# EAGLE schematic PecanPico7 (EAGLE 7.2.0)
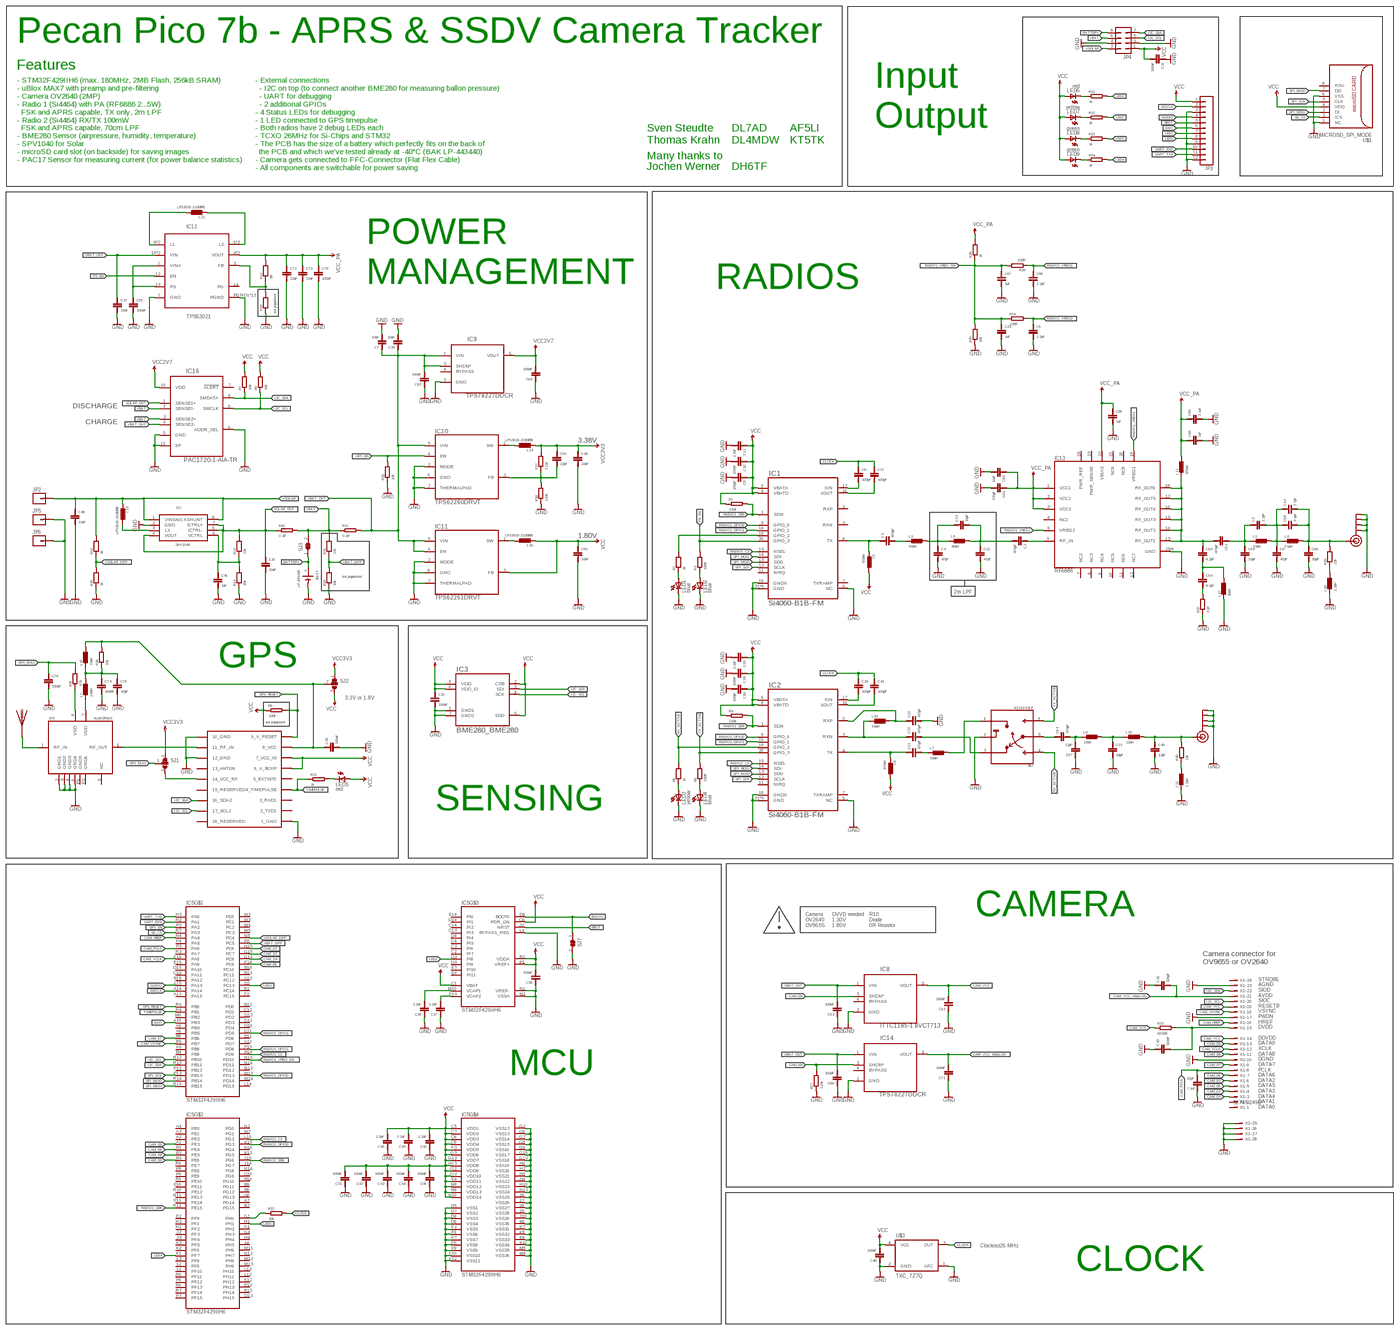
[diagram p0: schematic, sheet 1, overview]
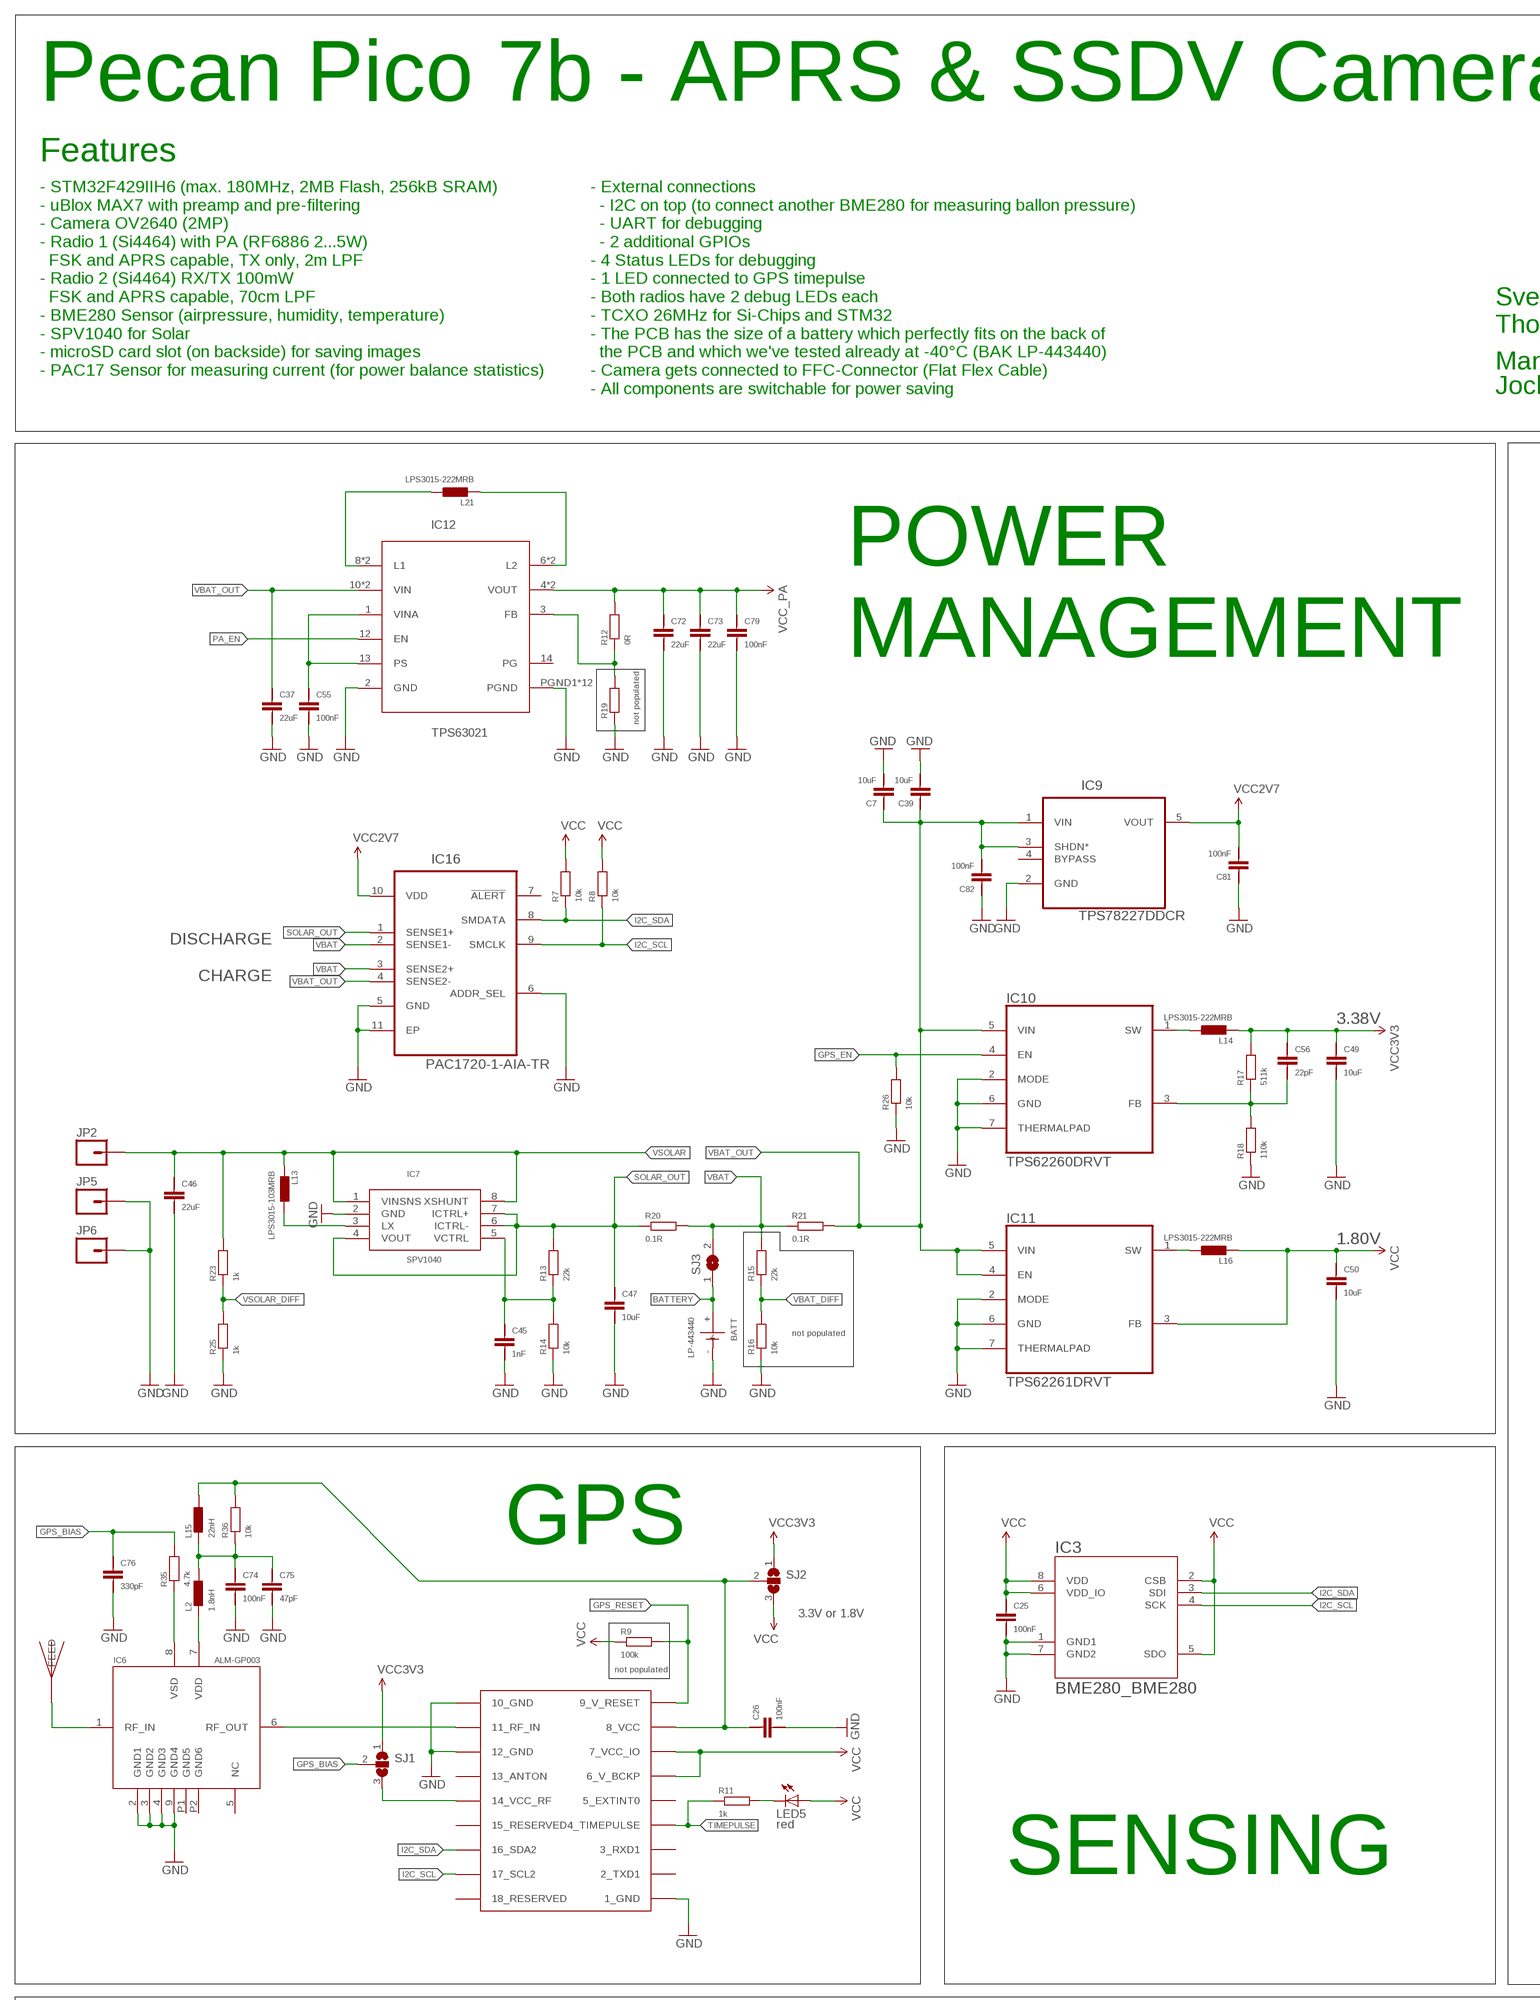
[diagram p1: schematic, sheet 1, part 1 of 4]
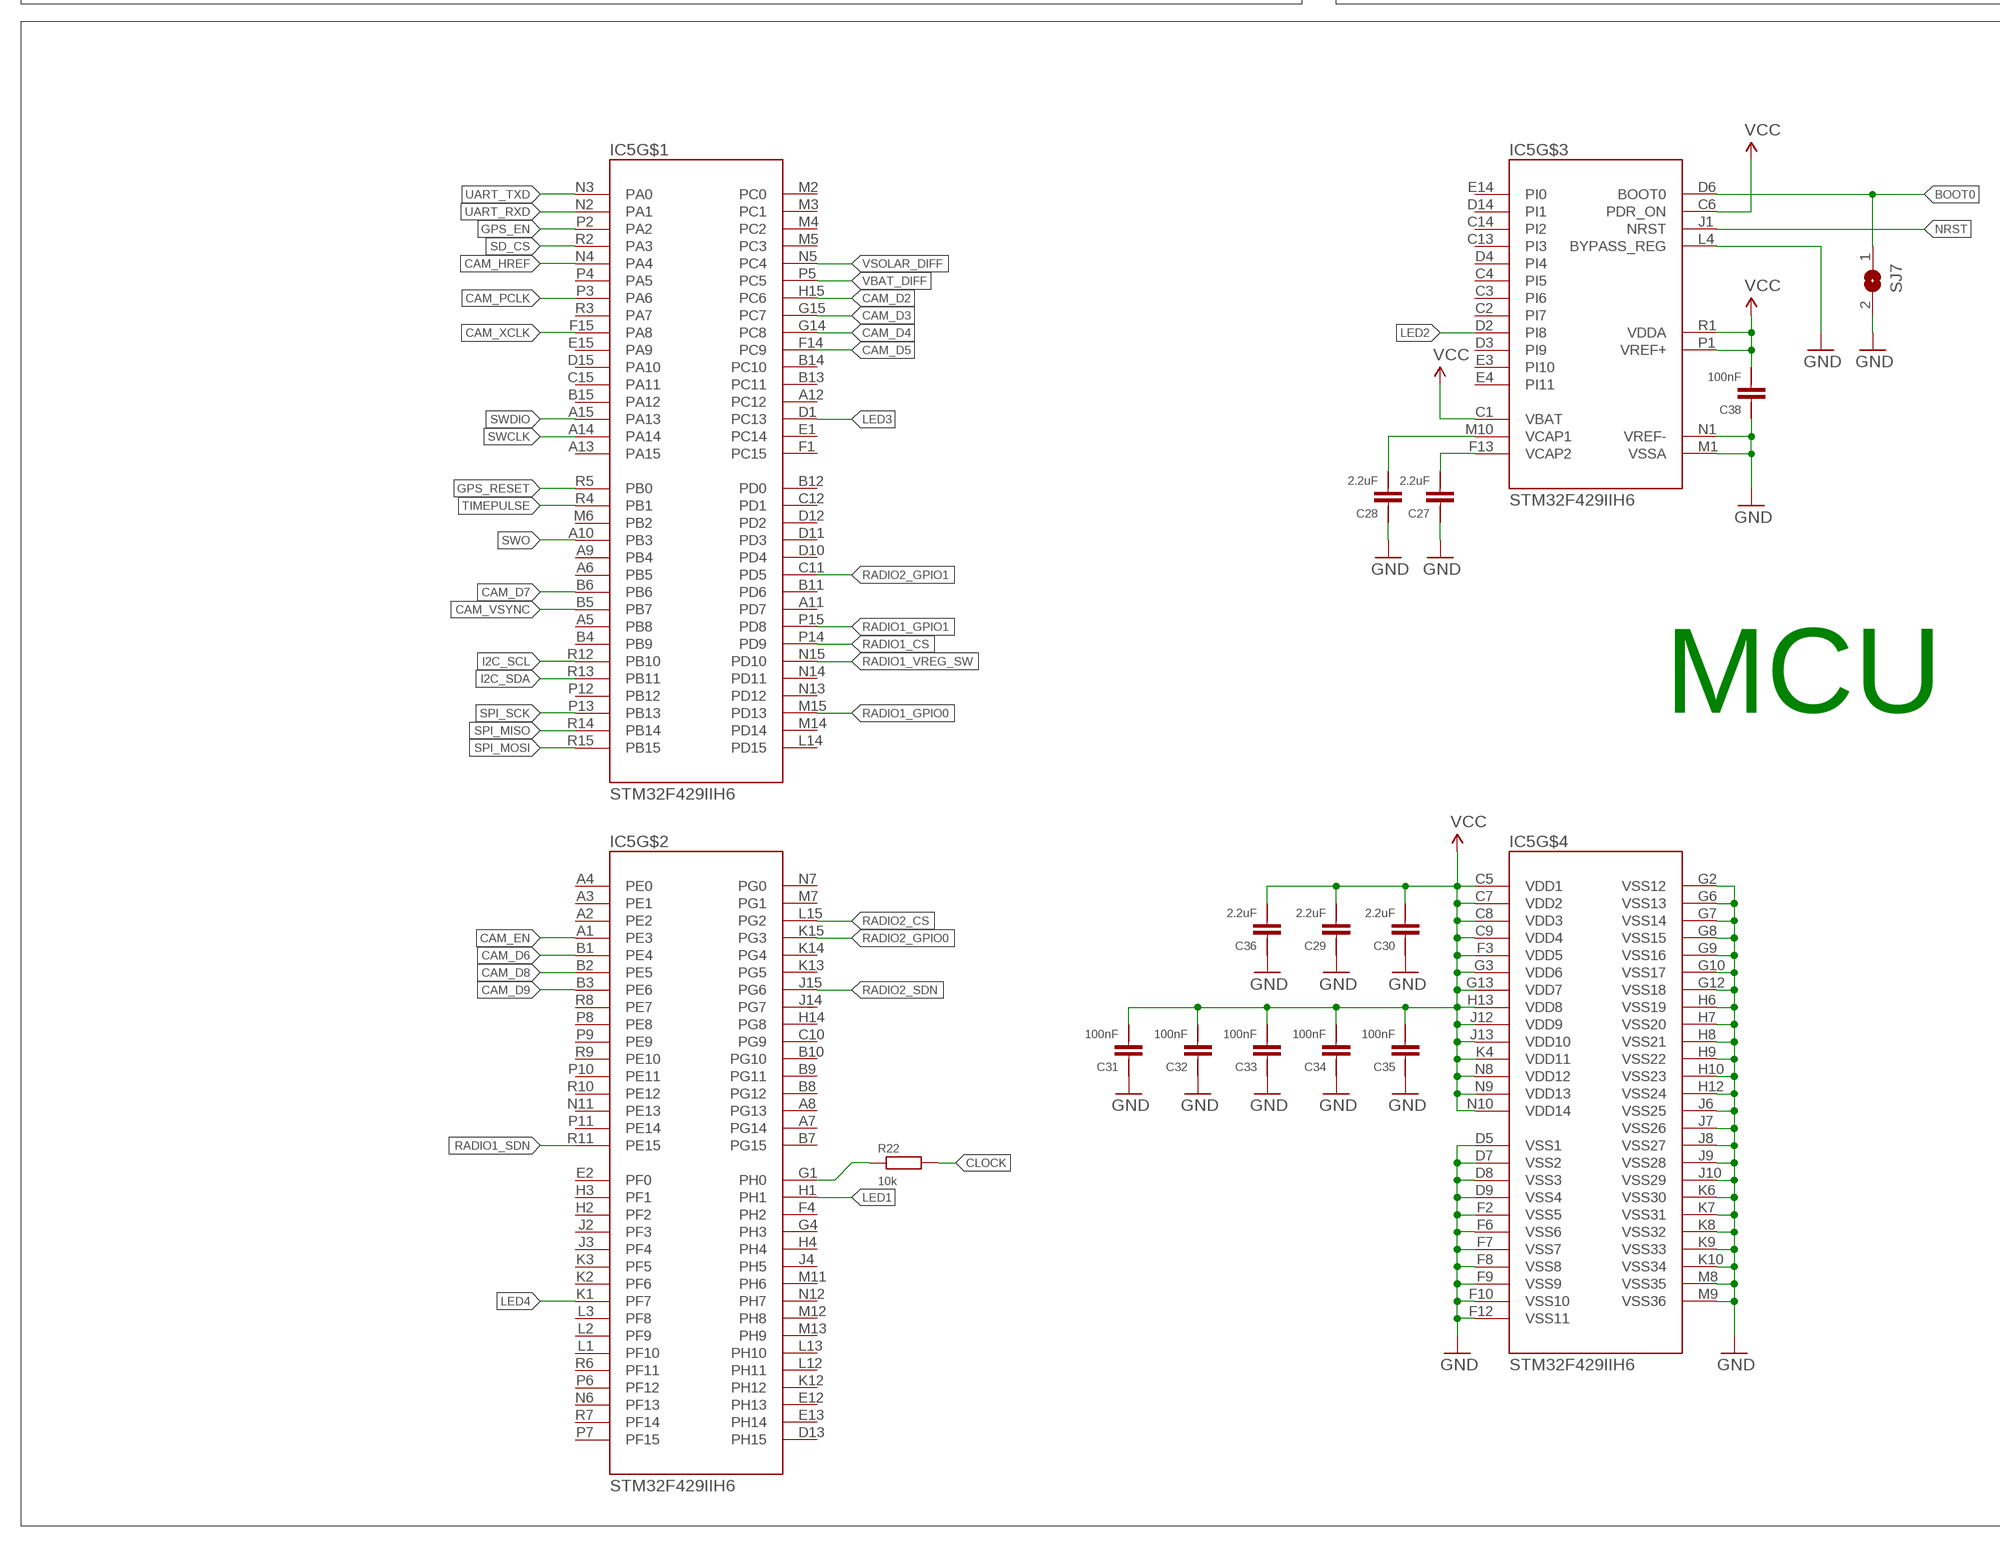
[diagram p2: schematic, sheet 1, part 2 of 4]
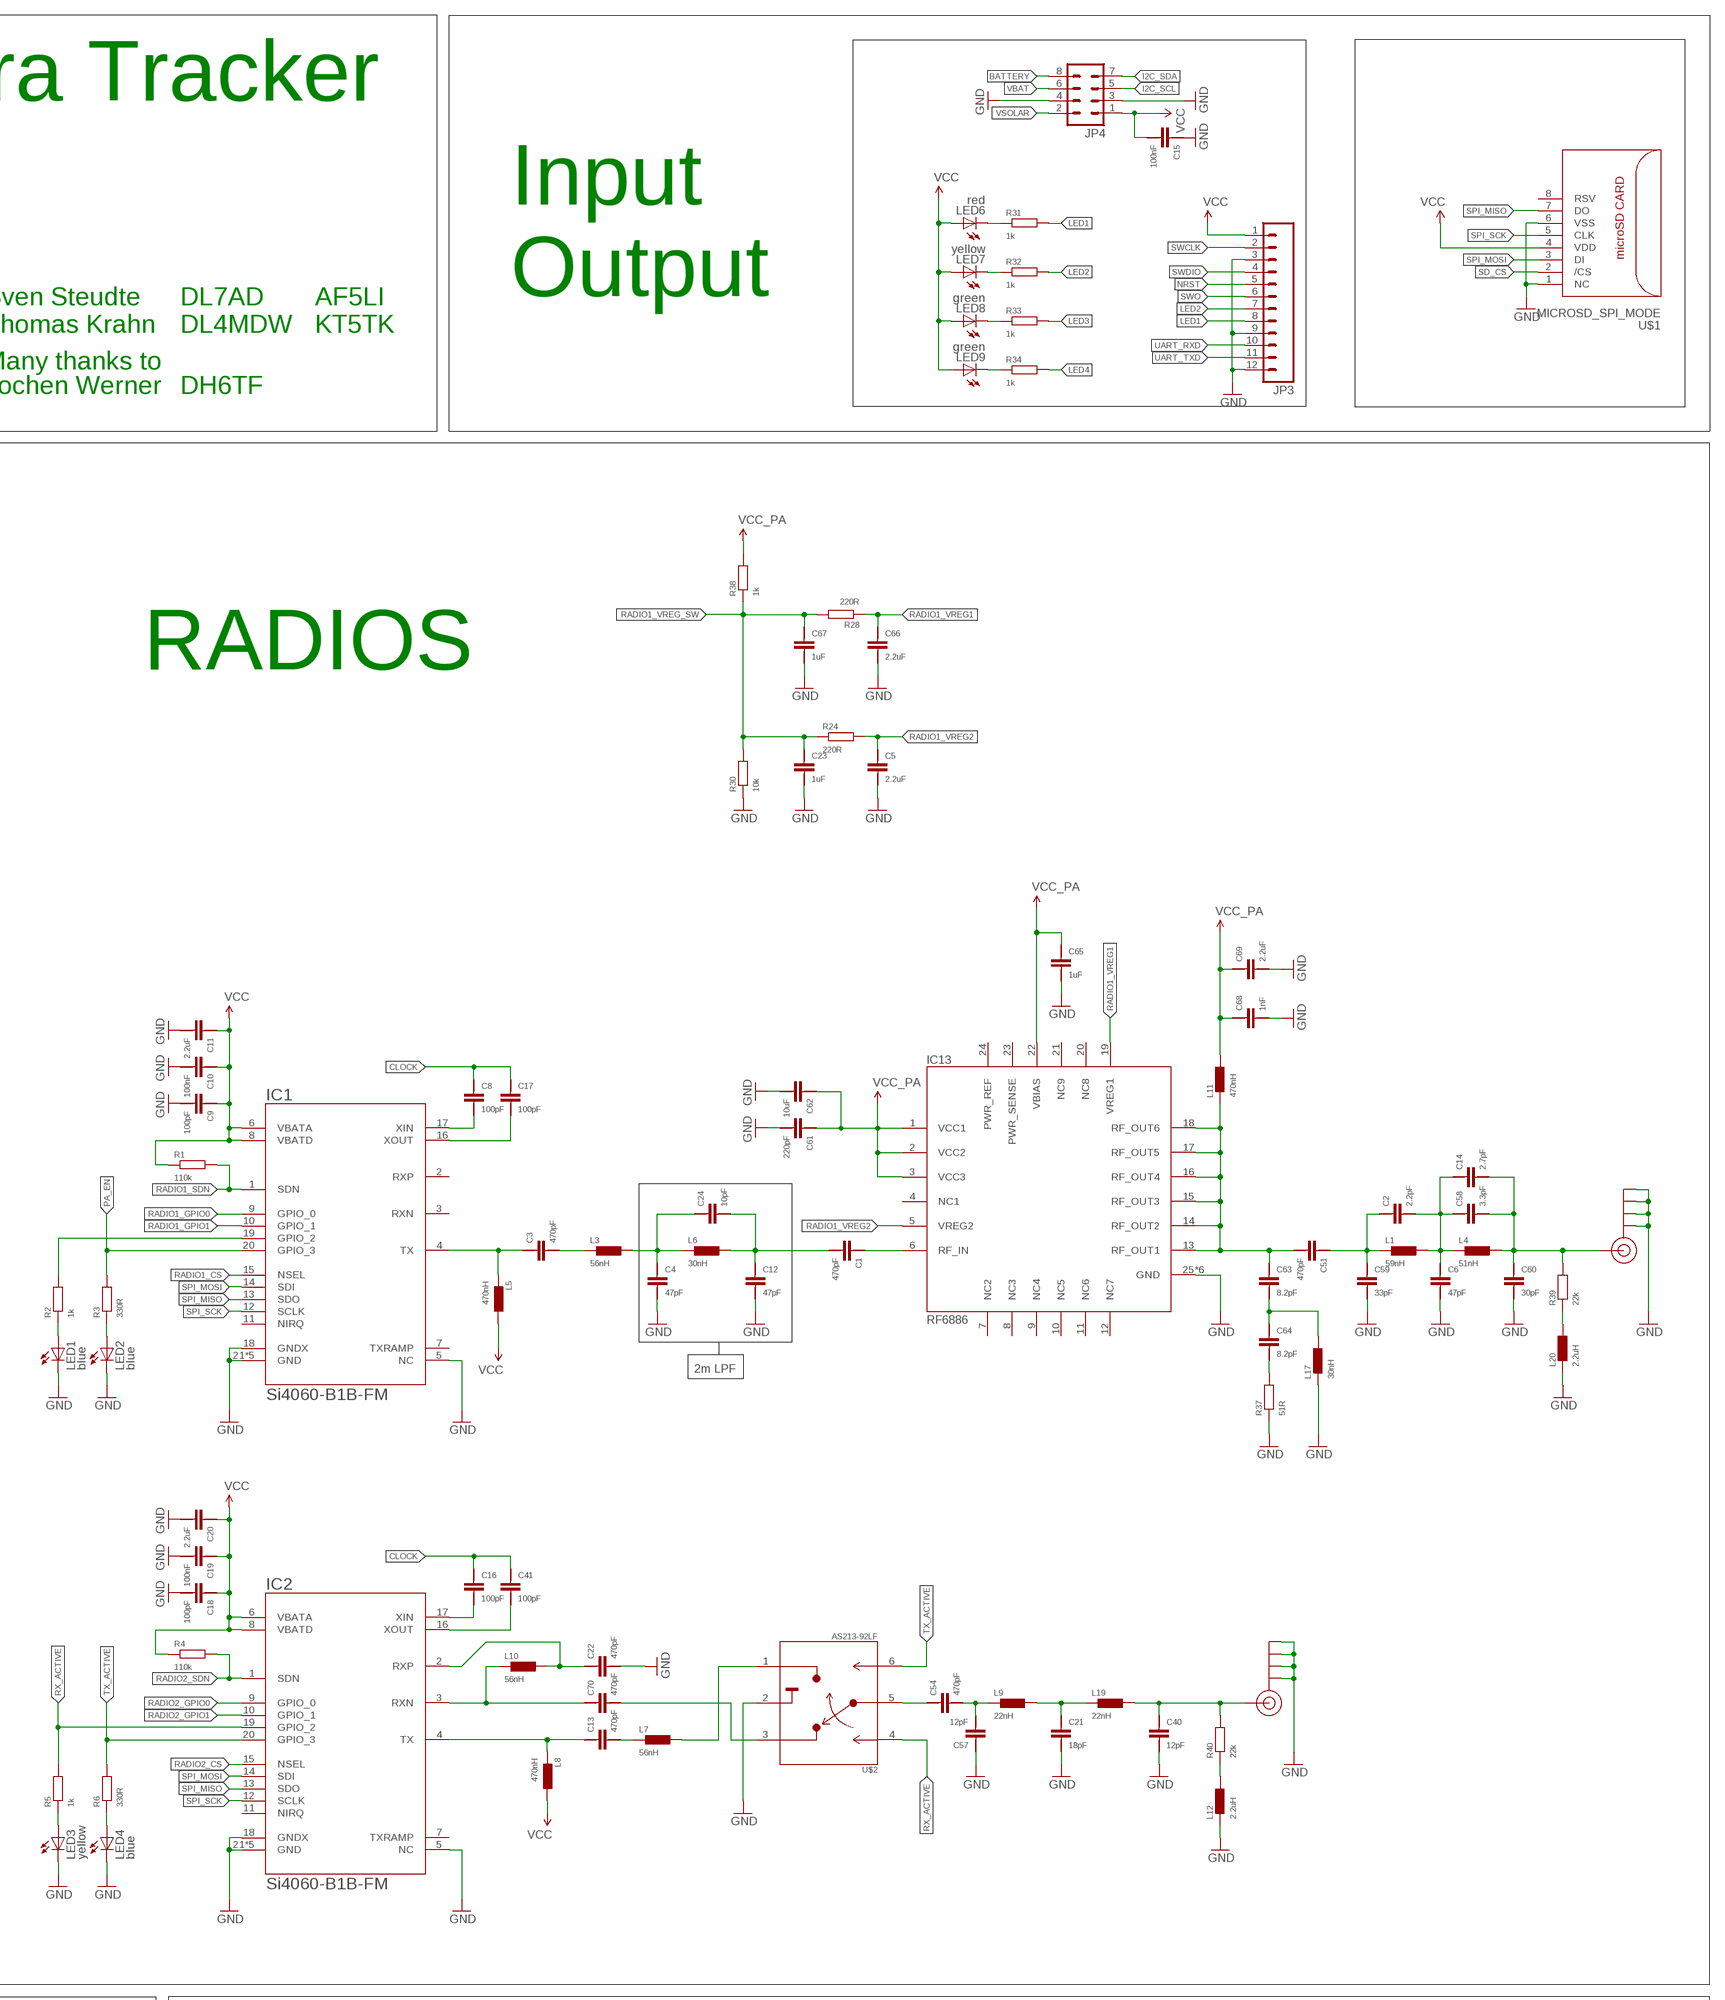
[diagram p3: schematic, sheet 1, part 3 of 4]
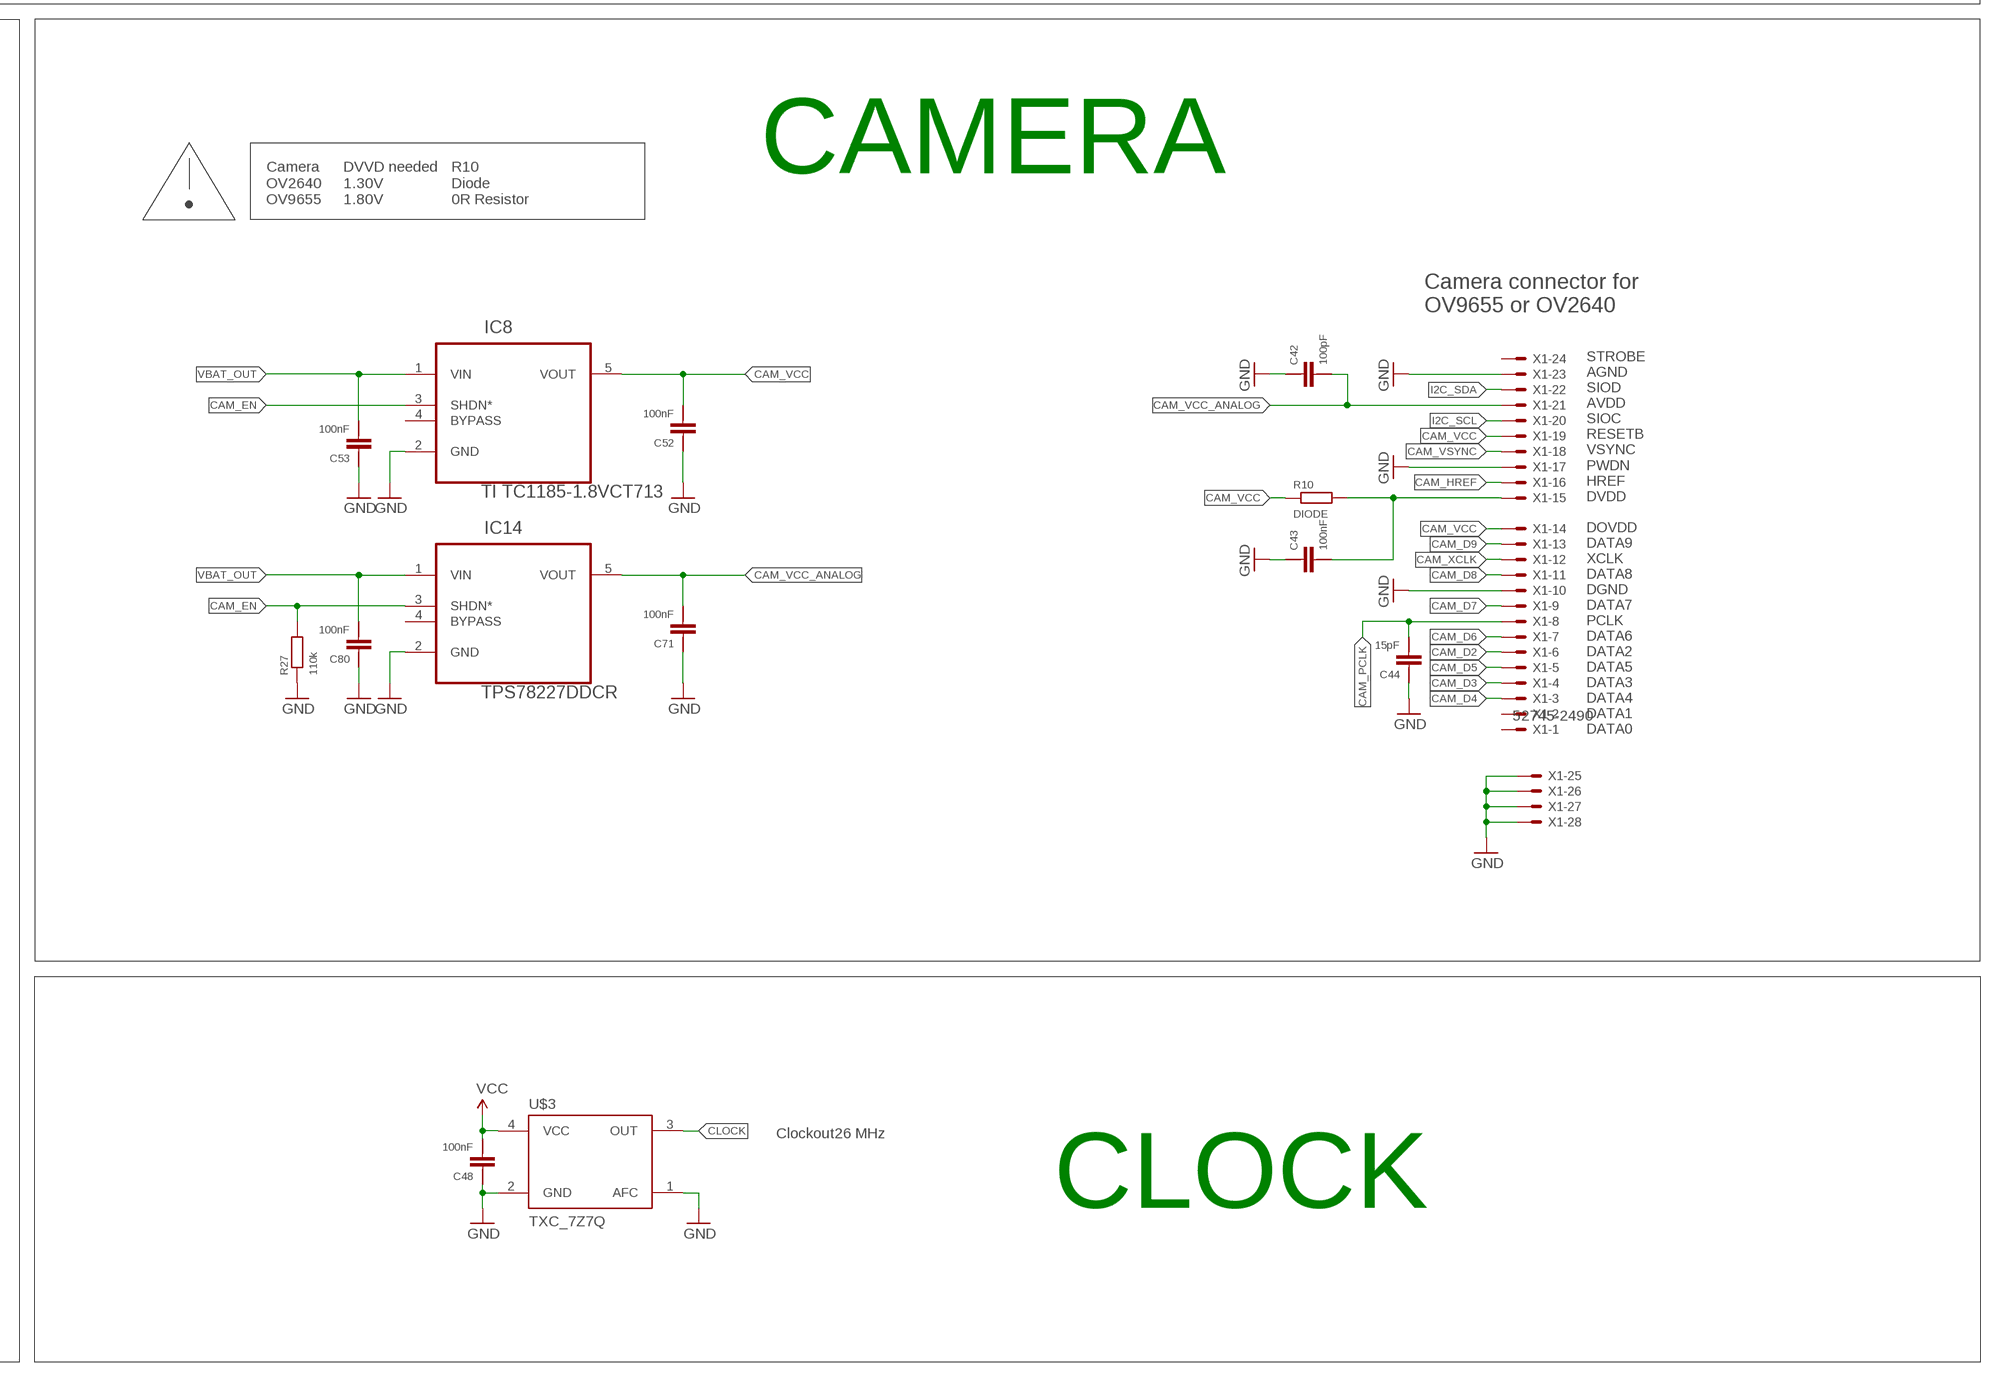
[diagram p4: schematic, sheet 1, part 4 of 4]

## Parts
BATT  LP-443440  [LP-443440]
C1  470pF  CAP-0402  [0402]
C2  2.2pF  CAP-0402  [0402]
C3  470pF  CAP-0402  [0402]
C4  47pF  CAP-0402  [0402]
C5  2.2uF  CAP-0402  [0402]
C6  47pF  CAP-0402  [0402]
C7  10uF  CAP-0805  [0805]
C8  100pF  CAP-0402  [0402]
C9  100pF  CAP-0402  [0402]
C10  100nF  CAP-0402  [0402]
C11  2.2uF  CAP-0402  [0402]
C12  47pF  CAP-0402  [0402]
C13  470pF  CAP-0402  [0402]
C14  2.7pF  CAP-0402  [0402]
C15  100nF  CAP-0402  [0402]
C16  100pF  CAP-0402  [0402]
C17  100pF  CAP-0402  [0402]
C18  100pF  CAP-0402  [0402]
C19  100nF  CAP-0402  [0402]
C20  2.2uF  CAP-0402  [0402]
C21  18pF  CAP-0402  [0402]
C22  470pF  CAP-0402  [0402]
C23  1uF  CAP-0402  [0402]
C24  10pF  CAP-0402  [0402]
C25  100nF  CAP-0402  [0402]
C26  100nF  CAP-0402  [0402]
C27  2.2uF  CAP-0402  [0402]
C28  2.2uF  CAP-0402  [0402]
C29  2.2uF  CAP-0402  [0402]
C30  2.2uF  CAP-0402  [0402]
C31  100nF  CAP-0402  [0402]
C32  100nF  CAP-0402  [0402]
C33  100nF  CAP-0402  [0402]
C34  100nF  CAP-0402  [0402]
C35  100nF  CAP-0402  [0402]
C36  2.2uF  CAP-0402  [0402]
C37  22uF  CAP-0805  [0805]
C38  100nF  CAP-0402  [0402]
C39  10uF  CAP-0805  [0805]
C40  12pF  CAP-0402  [0402]
C41  100pF  CAP-0402  [0402]
C42  100pF  CAP-0402  [0402]
C43  100nF  CAP-0402  [0402]
C44  15pF  CAP-0402  [0402]
C45  1nF  CAP-0402  [0402]
C46  22uF  CAP-0805  [0805]
C47  10uF  CAP-0805  [0805]
C48  100nF  CAP-0402  [0402]
C49  10uF  CAP-0805  [0805]
C50  10uF  CAP-0805  [0805]
C51  470pF  CAP-0402  [0402]
C52  100nF  CAP-0402  [0402]
C53  100nF  CAP-0402  [0402]
C54  470pF  CAP-0402  [0402]
C55  100nF  CAP-0402  [0402]
C56  22pF  CAP-0402  [0402]
C57  12pF  CAP-0402  [0402]
C58  3.3pF  CAP-0402  [0402]
C59  33pF  CAP-0402  [0402]
C60  30pF  CAP-0402  [0402]
C61  220pF  CAP-0402  [0402]
C62  10uF  CAP-0805  [0805]
C63  8.2pF  CAP-0402  [0402]
C64  8.2pF  CAP-0402  [0402]
C65  1uF  CAP-0402  [0402]
C66  2.2uF  CAP-0402  [0402]
C67  1uF  CAP-0402  [0402]
C68  1nF  CAP-0402  [0402]
C69  2.2uF  CAP-0402  [0402]
C70  470pF  CAP-0402  [0402]
C71  100nF  CAP-0402  [0402]
C72  22uF  CAP-0805  [0805]
C73  22uF  CAP-0805  [0805]
C74  100nF  CAP-0402  [0402]
C75  47pF  CAP-0402  [0402]
C76  330pF  CAP-0402  [0402]
C79  100nF  CAP-0402  [0402]
C80  100nF  CAP-0402  [0402]
C81  100nF  CAP-0402  [0402]
C82  100nF  CAP-0402  [0402]
IC1  Si4060-B1B-FM  SI4463/4  [QFN-20]
IC2  Si4060-B1B-FM  SI4463/4  [QFN-20]
IC3  BME280_BME280  [BME280_BME280]
IC4  uBlox MAX7/8  UBLOX_MAX-6  [UBLOX_MAX-6]
IC5  STM32F429IIH6  [UFBGA176]
IC6  ALM-GP003  [ALM-GP003]
IC7  SPV1040  [TSSOP8]
IC8  TI TC1185-1.8VCT713  TC1185-1.8VCT713  [SOT95P290X145-5N]
IC9  TPS78227DDCR  TC1185-1.8VCT713  [SOT95P290X145-5N]
IC10  TPS62260DRVT  [SON65P210X210X80-7N]
IC11  TPS62261DRVT  TPS62260DRVT  [SON65P210X210X80-7N]
IC12  TPS63021  TPS63020  [QFN-14]
IC13  RF6886  [QFN-24]
IC14  TPS78227DDCR  TC1185-1.8VCT713  [SOT95P290X145-5N]
IC16  PAC1720-1-AIA-TR  [DFN300X300X90-11N]
J$1  SMA_EDGE  [SMA-EDGE]
J$2  SMA_EDGE  [SMA-EDGE]
JP2  M01SMD  [LUXEON-PAD]
JP3  M12PTH  [1X12]
JP4  M04X2SMD  [2X4_2]
JP5  M01SMD  [LUXEON-PAD]
JP6  M01SMD  [LUXEON-PAD]
L1  59nH  IND-04020603  [0603@1]
L2  1.8nH  IND-0402  [0402]
L3  56nH  IND-0402  [0402]
L4  51nH  IND-04020603  [0603@1]
L5  470nH  IND-04020805  [0805@1]
L6  30nH  IND-0402  [0402]
L7  56nH  IND-0402  [0402]
L8  470nH  IND-04020805  [0805@1]
L9  22nH  IND-0402  [0402]
L10  56nH  IND-0402  [0402]
L11  470nH  IND-04020805  [0805@1]
L12  2.2uH  IND-0402  [0402]
L13  LPS3015-103MRB  IND-LPS3015  [LPS3015]
L14  LPS3015-222MRB  IND-LPS3015  [LPS3015]
L15  22nH  IND-0402  [0402]
L16  LPS3015-222MRB  IND-LPS3015  [LPS3015]
L17  30nH  IND-04020603  [0603@1]
L19  22nH  IND-0402  [0402]
L20  2.2uH  IND-0402  [0402]
L21  LPS3015-222MRB  IND-LPS3015  [LPS3015]
LED1  blue  LED0603  [LED-0603]
LED2  blue  LED0603  [LED-0603]
LED3  yellow  LED0603  [LED-0603]
LED4  blue  LED0603  [LED-0603]
LED5  red  LED0603  [LED-0603]
LED6  red  LED0603  [LED-0603]
LED7  yellow  LED0603  [LED-0603]
LED8  green  LED0603  [LED-0603]
LED9  green  LED0603  [LED-0603]
R1  110k  RES-0402  [0402]
R2  1k  RES-0402  [0402]
R3  330R  RES-0402  [0402]
R4  110k  RES-0402  [0402]
R5  1k  RES-0402  [0402]
R6  330R  RES-0402  [0402]
R7  10k  RES-0402  [0402]
R8  10k  RES-0402  [0402]
R9  100k  RES-0402  [0402]
R10  DIODE  RES-0402  [0402]
R11  1k  RES-0402  [0402]
R12  0R  RES-0402  [0402]
R13  22k  RES-0402  [0402]
R14  10k  RES-0402  [0402]
R15  22k  RES-0402  [0402]
R16  10k  RES-0402  [0402]
R17  511k  RES-0402  [0402]
R18  110k  RES-0402  [0402]
R19  RES-0402  [0402]
R20  0.1R  RES-04020603  [0603]
R21  0.1R  RES-04020603  [0603]
R22  10k  RES-0402  [0402]
R23  1k  RES-0402  [0402]
R24  220R  RES-0402  [0402]
R25  1k  RES-0402  [0402]
R26  10k  RES-0402  [0402]
R27  110k  RES-0402  [0402]
R28  220R  RES-0402  [0402]
R30  10k  RES-0402  [0402]
R31  1k  RES-0402  [0402]
R32  1k  RES-0402  [0402]
R33  1k  RES-0402  [0402]
R34  1k  RES-0402  [0402]
R35  4.7k  RES-0402  [0402]
R36  10k  RES-0402  [0402]
R37  51R  RES-0402  [0402]
R38  1k  RES-0402  [0402]
R39  22k  RES-0402  [0402]
R40  22k  RES-0402  [0402]
SJ1  SJ2W  [SJ_2]
SJ2  SJ2W  [SJ_2]
SJ3  SJ  [SJ]
SJ7  SJ  [SJ]
U$1  MICROSD_SPI_MODE  [MICRO_SD_CONNECTOR]
U$2  AS213-92LF  [SC-70]
U$3  TXC_7Z7Q  [TCXO_3.2X2.5]
U$4  JTI_ANTENNA-1575AT43A40  [JTI_ANTENNA-1575AT43A40]
X1  52745-2490  [52745-2490]

## Nets
BATTERY: BATT.+ JP4.8 SJ3.1
BOOT0: IC5.D6(BOOT0) SJ7.1
CAM_D2: IC5.H15(PC6) X1.6
CAM_D3: IC5.G15(PC7) X1.4
CAM_D4: IC5.G14(PC8) X1.3
CAM_D5: IC5.F14(PC9) X1.5
CAM_D6: IC5.B1(PE4) X1.7
CAM_D7: IC5.B6 X1.9
CAM_D8: IC5.B2(PE5) X1.11
CAM_D9: IC5.B3(PE6) X1.13
CAM_EN: IC5.A1(PE3) IC8.3(SHDN*) IC14.3(SHDN*) R27.P$2
CAM_HREF: IC5.N4(PA4) X1.16
CAM_PCLK: C44.P$1 IC5.P3(PA6) X1.8
CAM_VCC: C52.P$1 IC8.5(VOUT) R10.P$1 X1.14 X1.19
CAM_VCC_ANALOG: C42.P$1 C71.P$1 IC14.5(VOUT) X1.21
CAM_VSYNC: IC5.B5(PB7) X1.18
CAM_XCLK: IC5.F15(PA8) X1.12
CLOCK: C8.P$2 C16.P$2 C17.P$2 C41.P$2 R22.P$2 U$3.3(OUT)
GND: BATT.- C4.P$1 C5.P$1 C6.P$1 C7.1 C9.P$1 C10.P$1 C11.P$1 C12.P$1 C15.P$2 C18.P$1 C19.P$1 C20.P$1 C21.P$1 C22.P$1 C23.P$1 C25.P$1 C26.P$1 C27.P$2 C28.P$2 C29.P$2 C30.P$2 C31.P$2 C32.P$2 C33.P$2 C34.P$2 C35.P$2 C36.P$2 C37.1 C38.P$2 C39.1 C40.P$1 C42.P$2 C43.P$2 C44.P$2 C45.P$1 C46.1 C47.1 C48.P$2 C49.1 C50.1 C52.P$2 C53.P$2 C55.P$1 C57.P$2 C59.P$1 C60.P$1 C61.P$1 C62.1 C65.P$1 C66.P$1 C67.P$1 C68.P$1 C69.P$1 C71.P$2 C72.1 C73.1 C74.P$1 C75.P$1 C76.P$1 C79.P$1 C80.P$2 C81.P$2 C82.P$2 IC1.5(NC) IC1.18(GNDX) IC1.21(GND) IC1.22(GND) IC1.23(GND) IC1.24(GND) IC1.25(GND) IC2.5(NC) IC2.18(GNDX) IC2.21(GND) IC2.22(GND) IC2.23(GND) IC2.24(GND) IC2.25(GND) IC3.1(GND1) IC3.7(GND2) IC4.1_GND IC4.10_GND IC4.12_GND IC5.D5(VSS1) IC5.D7(VSS2) IC5.D8(VSS3) IC5.D9(VSS4) IC5.F2(VSS5) IC5.F6(VSS6) IC5.F7(VSS7) IC5.F8(VSS8) IC5.F9(VSS9) IC5.F10(VSS10) IC5.F12(VSS11) IC5.G2(VSS12) IC5.G6(VSS13) IC5.G7(VSS14) IC5.G8(VSS15) IC5.G9(VSS16) IC5.G10(VSS17) IC5.G12(VSS18) IC5.H6(VSS19) IC5.H7(VSS20) IC5.H8(VSS21) IC5.H9(VSS22) IC5.H10(VSS23) IC5.H12(VSS24) IC5.J6(VSS25) IC5.J7(VSS26) IC5.J8(VSS27) IC5.J9(VSS28) IC5.J10(VSS29) IC5.K6(VSS30) IC5.K7(VSS31) IC5.K8(VSS32) IC5.K9(VSS33) IC5.K10(VSS34) IC5.L4(BYPASS_REG) IC5.M1(VSSA) IC5.M8(VSS35) IC5.M9(VSS36) IC5.N1(VREF-) IC6.2(GND1) IC6.3(GND2) IC6.4(GND3) IC6.9(GND4) IC7.2(GND) IC8.2(GND) IC9.2(GND) IC10.2(MODE) IC10.6(GND) IC10.7(THERMALPAD) IC11.2(MODE) IC11.6(GND) IC11.7(THERMALPAD) IC12.2(GND) IC12.PGND1(PGND) IC12.PGND2(PGND) IC12.PGND3(PGND) IC12.PGND4(PGND) IC12.PGND5(PGND) IC12.PGND6(PGND) IC12.PGND7(PGND) IC12.PGND8(PGND) IC12.PGND9(PGND) IC12.PGND10(PGND) IC12.PGND11(PGND) IC12.PGND12(PGND) IC13.25(GND) IC13.GND IC13.P$26(GND) IC13.P$27(GND) IC13.P$28(GND) IC13.P$29(GND) IC14.2(GND) IC16.5(GND) IC16.6(ADDR_SEL) IC16.11(EP) J$1.GND@0(GND) J$1.GND@1(GND) J$1.GND@2(GND) J$1.GND@3(GND) J$2.GND@0(GND) J$2.GND@1(GND) J$2.GND@2(GND) J$2.GND@3(GND) JP3.3 JP3.9 JP3.12 JP4.3 JP4.4 JP5.P$1 JP6.P$1 L12.P$1 L17.P$1 L20.P$1 LED1.C LED2.C LED3.C LED4.C R14.P$1 R16.P$1 R18.P$1 R19.P$1 R25.P$1 R26.P$1 R27.P$1 R30.P$1 R37.P$1 SJ7.2 U$1.1(NC) U$1.6(VSS) U$2.2(GND) U$3.1(AFC) U$3.2(GND) X1.10 X1.17 X1.23 X1.P$1 X1.P$2 X1.P$3 X1.P$4
GPS_BIAS: C76.P$2 R35.P$2 SJ1.2
GPS_EN: IC5.P2(PA2) IC10.4(EN) R26.P$2
GPS_RESET: IC4.9_V_RESET IC5.R5(PB0) R9.P$2
I2C_SCL: IC3.4(SCK) IC4.17_SCL2 IC5.R12(PB10) IC16.9(SMCLK) JP4.5 R8.P$1 X1.20
I2C_SDA: IC3.3(SDI) IC4.16_SDA2 IC5.R13(PB11) IC16.8(SMDATA) JP4.7 R7.P$1 X1.22
LED1: IC5.H1 JP3.8 R31.P$2
LED2: IC5.D2(PI8) JP3.7 R32.P$2
LED3: IC5.D1(PC13) R33.P$2
LED4: IC5.K1(PF7) R34.P$2
N$1: C4.P$2 C24.P$2 L3.P$2 L6.P$1
N$2: C3.P$2 IC1.4(TX) L5.P$1
N$3: C3.P$1 L3.P$1
N$4: C70.P$2 IC2.3(RXN) L10.P$1
N$5: C2.P$1 C6.P$2 C14.P$2 C58.P$2 L1.P$2 L4.P$1
N$6: C1.P$2 IC13.6(RF_IN)
N$7: IC6.1(RF_IN) U$4.FEED
N$8: C2.P$2 C51.P$2 C59.P$2 L1.P$1
N$9: C17.P$1 IC1.16(XOUT)
N$10: C1.P$1 C12.P$2 C24.P$1 L6.P$2
N$11: L7.P$2 U$2.1(B2)
N$12: C43.P$1 R10.P$2 X1.15
N$13: IC1.19(GPIO_2) R2.P$2
N$15: C13.P$2 IC2.4(TX) L8.P$1
N$16: C13.P$1 L7.P$1
N$17: C63.P$1 C64.P$2 L17.P$2
N$18: C16.P$1 IC2.17(XIN)
N$19: C41.P$1 IC2.16(XOUT)
N$20: LED3.A R5.P$1
N$21: LED1.A R2.P$1
N$22: LED2.A R3.P$1
N$23: LED4.A R6.P$1
N$24: C64.P$1 R37.P$2
N$25: C21.P$2 L9.P$2 L19.P$1
N$26: C70.P$1 U$2.3(B1)
N$27: LED5.C R11.P$2
N$28: C56.P$1 IC10.3(FB) R17.P$1 R18.P$2
N$29: C40.P$2 J$2.SIG(SIGNAL) L19.P$2 R40.P$2
N$30: IC10.1(SW) L14.2_1 L14.2_2 L14.2_3 L14.2_4 L14.2_5 L14.2_6 L14.2_7 L14.2_8 L14.2_9
N$31: IC11.1(SW) L16.2_1 L16.2_2 L16.2_3 L16.2_4 L16.2_5 L16.2_6 L16.2_7 L16.2_8 L16.2_9
N$32: C45.P$2 IC7.5(VCTRL) R13.P$1 R14.P$2
N$33: IC4.11_RF_IN IC6.6(RF_OUT)
N$35: C27.P$1 IC5.F13(VCAP2)
N$36: C28.P$1 IC5.M10(VCAP1)
N$37: C8.P$1 IC1.17(XIN)
N$38: IC7.3(LX) L13.2_1 L13.2_2 L13.2_3 L13.2_4 L13.2_5 L13.2_6 L13.2_7 L13.2_8 L13.2_9
N$39: IC5.G1(PH0) R22.P$1
N$40: C26.P$2 IC4.8_VCC L15.P$2 R36.P$2 SJ2.2
N$41: C14.P$1 C58.P$1 C60.P$2 J$1.SIG(SIGNAL) L4.P$2 R39.P$2
N$42: LED7.C R32.P$1
N$43: C51.P$1 C63.P$2 IC13.13(RF_OUT1) IC13.14(RF_OUT2) IC13.15(RF_OUT3) IC13.16(RF_OUT4) IC13.17(RF_OUT5) IC13.18(RF_OUT6) L11.P$1
N$44: IC12.8(L1) IC12.9(L1) L21.2_1 L21.2_2 L21.2_3 L21.2_4 L21.2_5 L21.2_6 L21.2_7 L21.2_8 L21.2_9
N$45: IC6.8(VSD) R35.P$1
N$46: IC6.7(VDD) L2.P$1
N$47: LED8.C R33.P$1
N$48: LED9.C R34.P$1
N$49: LED6.C R31.P$1
N$50: IC12.6(L2) IC12.7(L2) L21.1_1 L21.1_2 L21.1_3 L21.1_4 L21.1_5 L21.1_6 L21.1_7 L21.1_8 L21.1_9
N$51: C74.P$2 C75.P$2 L2.P$2 L15.P$1 R36.P$1
N$54: IC4.14_VCC_RF SJ1.3
N$55: C22.P$2 IC2.2(RXP) L10.P$2
N$56: L20.P$2 R39.P$1
N$58: C54.P$2 U$2.5(A1)
N$59: C54.P$1 C57.P$1 L9.P$1
N$61: L12.P$2 R40.P$1
N$62: IC12.3(FB) R12.P$1 R19.P$2
N$63: C55.P$2 IC12.1(VINA) IC12.13(PS)
NRST: IC5.J1(NRST) JP3.5
PA_EN: IC1.20(GPIO_3) IC12.12(EN) R3.P$2
RADIO1_CS: IC1.15(NSEL) IC5.P14(PD9)
RADIO1_GPIO0: IC1.9(GPIO_0) IC5.M15(PD13)
RADIO1_GPIO1: IC1.10(GPIO_1) IC5.P15(PD8)
RADIO1_SDN: IC1.1(SDN) IC5.R11(PE15) R1.P$2
RADIO1_VREG1: C66.P$2 IC13.19(VREG1) R28.P$1
RADIO1_VREG2: C5.P$2 IC13.5(VREG2) R24.P$2
RADIO1_VREG_SW: C23.P$2 C67.P$2 IC5.N15(PD10) R24.P$1 R28.P$2 R30.P$2 R38.P$1
RADIO2_CS: IC2.15(NSEL) IC5.L15(PG2)
RADIO2_GPIO0: IC2.9(GPIO_0) IC5.K15(PG3)
RADIO2_GPIO1: IC2.10(GPIO_1) IC5.C11(PD5)
RADIO2_SDN: IC2.1(SDN) IC5.J15(PG6) R4.P$2
RX_ACTIVE: IC2.19(GPIO_2) R5.P$2 U$2.4(V2)
SD_CS: IC5.R2(PA3) U$1.2(/CS)
SOLAR_OUT: C47.2 IC7.4(VOUT) IC7.6(ICTRL-) IC7.7(ICTRL+) IC16.1(SENSE1+) R13.P$2 R20.P$1
SPI_MISO: IC1.13(SDO) IC2.13(SDO) IC5.R14(PB14) U$1.7(DO)
SPI_MOSI: IC1.14(SDI) IC2.14(SDI) IC5.R15(PB15) U$1.3(DI)
SPI_SCK: IC1.12(SCLK) IC2.12(SCLK) IC5.P13(PB13) U$1.5(CLK)
SWCLK: IC5.A14 JP3.2
SWDIO: IC5.A15(PA13) JP3.4
SWO: IC5.A10(PB3) JP3.6
TIMEPULSE: IC4.4_TIMEPULSE IC5.R4(PB1) R11.P$1
TX_ACTIVE: IC2.20(GPIO_3) R6.P$2 U$2.6(V1)
UART_RXD: IC5.N2(PA1) JP3.10
UART_TXD: IC5.N3(PA0) JP3.11
VBAT: IC16.2(SENSE1-) IC16.3(SENSE2+) JP4.6 R15.P$2 R20.P$2 R21.P$1 SJ3.2
VBAT_DIFF: IC5.P5(PC5) R15.P$1 R16.P$2
VBAT_OUT: C7.2 C37.2 C39.2 C53.P$1 C80.P$1 C82.P$1 IC8.1(VIN) IC9.1(VIN) IC9.3(SHDN*) IC10.5(VIN) IC11.4(EN) IC11.5(VIN) IC12.10(VIN) IC12.11(VIN) IC14.1(VIN) IC16.4(SENSE2-) R21.P$2
VCC: C9.P$2 C10.P$2 C11.P$2 C15.P$1 C18.P$2 C19.P$2 C20.P$2 C25.P$2 C29.P$1 C30.P$1 C31.P$1 C32.P$1 C33.P$1 C34.P$1 C35.P$1 C36.P$1 C38.P$1 C48.P$1 C50.2 IC1.6(VBATA) IC1.8(VBATD) IC2.6(VBATA) IC2.8(VBATD) IC3.2(CSB) IC3.5(SDO) IC3.6(VDD_IO) IC3.8(VDD) IC4.6_V_BCKP IC4.7_VCC_IO IC5.C1(VBAT) IC5.C5(VDD1) IC5.C6(PDR_ON) IC5.C7(VDD2) IC5.C8(VDD3) IC5.C9(VDD4) IC5.F3(VDD5) IC5.G3(VDD6) IC5.G13(VDD7) IC5.H13(VDD8) IC5.J12(VDD9) IC5.J13(VDD10) IC5.K4(VDD11) IC5.N8(VDD12) IC5.N9(VDD13) IC5.N10(VDD14) IC5.P1(VREF+) IC5.R1(VDDA) IC11.3(FB) JP3.1 JP4.1 L5.P$2 L8.P$2 L16.1_1 L16.1_2 L16.1_3 L16.1_4 L16.1_5 L16.1_6 L16.1_7 L16.1_8 L16.1_9 LED5.A LED6.A LED7.A LED8.A LED9.A R1.P$1 R4.P$1 R7.P$2 R8.P$2 R9.P$1 SJ2.3 U$1.4(VDD) U$3.4(VCC)
VCC2V7: C81.P$1 IC9.5(VOUT) IC16.10(VDD)
VCC3V3: C49.2 C56.P$2 L14.1_1 L14.1_2 L14.1_3 L14.1_4 L14.1_5 L14.1_6 L14.1_7 L14.1_8 L14.1_9 R17.P$2 SJ1.1 SJ2.1
VCC_PA: C61.P$2 C62.2 C65.P$2 C68.P$2 C69.P$2 C72.2 C73.2 C79.P$2 IC12.4(VOUT) IC12.5(VOUT) IC13.1(VCC1) IC13.2(VCC2) IC13.3(VCC3) IC13.22(VBIAS) L11.P$2 R12.P$2 R38.P$2
VSOLAR: C46.2 IC7.1(VINSNS) IC7.8(XSHUNT) JP2.P$1 JP4.2 L13.1_1 L13.1_2 L13.1_3 L13.1_4 L13.1_5 L13.1_6 L13.1_7 L13.1_8 L13.1_9 R23.P$2
VSOLAR_DIFF: IC5.N5(PC4) R23.P$1 R25.P$2
Unconnected: IC1.2(RXP) IC1.3(RXN) IC1.7(TXRAMP) IC1.11(NIRQ) IC2.7(TXRAMP) IC2.11(NIRQ) IC4.2_TXD1 IC4.3_RXD1 IC4.5_EXTINT0 IC4.13_ANTON IC4.15_RESERVED IC4.18_RESERVED IC5.A2(PE2) IC5.A3(PE1) IC5.A4(PE0) IC5.A5(PB8) IC5.A6(PB5) IC5.A7(PG14) IC5.A8(PG13) IC5.A9(PB4) IC5.A11(PD7) IC5.A12(PC12) IC5.A13(PA15) IC5.B4(PB9) IC5.B7(PG15) IC5.B8(PG12) IC5.B9(PG11) IC5.B10(PG10) IC5.B11(PD6) IC5.B12(PD0) IC5.B13(PC11) IC5.B14(PC10) IC5.B15(PA12) IC5.C2(PI7) IC5.C3(PI6) IC5.C4(PI5) IC5.C10(PG9) IC5.C12(PD1) IC5.C13(PI3) IC5.C14(PI2) IC5.C15(PA11) IC5.D3(PI9) IC5.D4(PI4) IC5.D10(PD4) IC5.D11(PD3) IC5.D12(PD2) IC5.D13(PH15) IC5.D14(PI1) IC5.D15(PA10) IC5.E1(PC14) IC5.E2(PF0) IC5.E3(PI10) IC5.E4(PI11) IC5.E12(PH13) IC5.E13(PH14) IC5.E14(PI0) IC5.E15(PA9) IC5.F1(PC15) IC5.F4(PH2) IC5.G4(PH3) IC5.H2(PF2) IC5.H3(PF1) IC5.H4 IC5.H14(PG8) IC5.J2(PF3) IC5.J3(PF4) IC5.J4(PH5) IC5.J14(PG7) IC5.K2(PF6) IC5.K3(PF5) IC5.K12(PH12) IC5.K13(PG5) IC5.K14(PG4) IC5.L1(PF10) IC5.L2(PF9) IC5.L3(PF8) IC5.L12(PH11) IC5.L13(PH10) IC5.L14(PD15) IC5.M2(PC0) IC5.M3(PC1) IC5.M4(PC2) IC5.M5(PC3) IC5.M6(PB2) IC5.M7(PG1) IC5.M11(PH6) IC5.M12(PH8) IC5.M13(PH9) IC5.M14(PD14) IC5.N6(PF13) IC5.N7(PG0) IC5.N11(PE13) IC5.N12(PH7) IC5.N13(PD12) IC5.N14(PD11) IC5.P4(PA5) IC5.P6(PF12) IC5.P7(PF15) IC5.P8(PE8) IC5.P9(PE9) IC5.P10(PE11) IC5.P11(PE14) IC5.P12(PB12) IC5.R3(PA7) IC5.R6(PF11) IC5.R7(PF14) IC5.R8(PE7) IC5.R9(PE10) IC5.R10(PE12) IC6.5(NC) IC6.P1(GND5) IC6.P2(GND6) IC8.4(BYPASS) IC9.4(BYPASS) IC12.14(PG) IC13.4(NC1) IC13.7(NC2) IC13.8(NC3) IC13.9(NC4) IC13.10(NC5) IC13.11(NC6) IC13.12(NC7) IC13.20(NC8) IC13.21(NC9) IC13.23(PWR_SENSE) IC13.24(PWR_REF) IC14.4(BYPASS) IC16.7(!ALERT) U$1.8(RSV) X1.1 X1.2 X1.24

## Notes on the sheet
- Pecan Pico 7b - APRS & SSDV Camera Tracker
- Features
- Input
  Output
- Sven Steudte
  Thomas Krahn
- DL7AD
  DL4MDW
- AF5LI
  KT5TK
- Many thanks to
- - STM32F429IIH6 (max. 180MHz, 2MB Flash, 256kB SRAM)
  - uBlox MAX7 with preamp and pre-filtering
  - Camera OV2640 (2MP)
  - Radio 1 (Si4464) with PA (RF6886 2...5W)
    FSK and APRS capable, TX only, 2m LPF
  - Radio 2 (Si4464) RX/TX 100mW
    FSK and APRS capable, 70cm LPF
  - BME280 Sensor (airpressure, humidity, temperature)
  - SPV1040 for Solar
  - microSD card slot (on backside) for saving images
  - PAC17 Sensor for measuring current (for power balance statistics)
- - External connections
    - I2C on top (to connect another BME280 for measuring ballon pressure)
    - UART for debugging
    - 2 additional GPIOs
  - 4 Status LEDs for debugging
  - 1 LED connected to GPS timepulse
  - Both radios have 2 debug LEDs each
  - TCXO 26MHz for Si-Chips and STM32
  - The PCB has the size of a battery which perfectly fits on the back of
    the PCB and which we've tested already at -40°C (BAK LP-443440)
  - Camera gets connected to FFC-Connector (Flat Flex Cable)
  - All components are switchable for power saving
- Jochen Werner | DH6TF
- POWER
  MANAGEMENT
- RADIOS
- not populated
- DISCHARGE
- CHARGE
- 3.38V
- 1.80V
- not populated
- 2m LPF
- GPS
- 3.3V or 1.8V
- not populated
- SENSING
- CAMERA
- Camera
  OV2640 
  OV9655
- DVVD needed
  1.30V
  1.80V
- R10
  Diode
  0R Resistor
- Camera connector for
  OV9655 or OV2640
- MCU
- STROBE
  AGND
  SIOD
  AVDD
  SIOC
  RESETB
  VSYNC
  PWDN
  HREF
  DVDD
  
  DOVDD
  DATA9
  XCLK
  DATA8
  DGND
  DATA7
  PCLK
  DATA6
  DATA2
  DATA5
  DATA3
  DATA4
  DATA1
  DATA0
- Clockout26 MHz
- CLOCK

## Library data of the parts
BATT = stm32f42x:LP-443440
C1-C6 C8-C36 C38 C40-C45 C48 C51-C61 C63-C71 C74-C76 C79-C82 = PecanPico6:CAP-0402
C7 C37 C39 C46 C47 C49 C50 C62 C72 C73 = PecanFemto3:CAP-0805
IC1 IC2 = PecanPico6:SI4463/4
IC3 = EXTERNAL_BME280:BME280_BME280
IC4 = PecanPico6:UBLOX_MAX-6: UBLOX MAX-6
IC5 = stm32f42x:STM32F429IIH6
IC6 = stm32f42x:ALM-GP003
IC7 = PecanPico6:SPV1040
IC8 IC9 IC14 = stm32f42x:TC1185-1.8VCT713: IC,150 mA CMOS LDOs with Shutdown and Reference Bypass,1.8V,SOT-23-5; MPN: TC1185-1.8VCT713; OC_FARNELL: 1331510; OC_NEWARK: 34M8771; PACKAGE: SOT-23-5; SUPPLIER: Microchip
IC10 IC11 = stm32f42x:TPS62260DRVT: 2.25 MHz 600 mA Step Down Converter in 2x2SON/TSOT-23 Package; MPN: TPS62260DRVT; OC_FARNELL: 82T3169; OC_NEWARK: 2075399; PACKAGE: Blue; SUPPLIER: Texas Instruments
IC12 = KT5TK2:TPS63020
IC13 = KT5TK:RF6886
IC16 = Microchip-PAC17:PAC1720-1-AIA-TR: IC, DUAL CURRENT SENSOR, DFN-10; MPN: PAC1720-1-AIA-TR; OC_FARNELL: 2362017; OC_NEWARK: 12X8751; PACKAGE: DFN-10; SUPPLIER: Microchip
J$1 J$2 = PecanPico4:SMA_EDGE: SMA Antenna Connector End launch SMA connector. The paste layer has been removed so that the connector can be hand soldered onto the board after reflow.
JP2 JP5 JP6 = SparkFun-Connectors:M01: Header 1 Standard 1-pin 0.1" header. Use with straight break away headers (SKU : PRT-00116), right angle break away headers (PRT-00553), swiss pins (PRT-00743), machine pins (PRT-00117), and female headers (PRT-00115).
JP3 = SparkFun-Connectors:M12: Header 12 Standard 12-pin 0.1" header. Use with straight break away headers (SKU : PRT-00116), right angle break away headers (PRT-00553), swiss pins (PRT-00743), machine pins (PRT-00117), and female headers (PRT-00115).
JP4 = SparkFun-Connectors:M04X2: .1" header, two rows of four.
L1 L4 L5 L8 L11 L17 = sven:IND-0402
L2 L3 L6 L7 L9 L10 L12 L15 L19 L20 = PecanPico6:IND-0402
L13 L14 L16 L21 = PecanPico6:IND-LPS3015
LED1-LED9 = PecanPico6:LED: LEDs Standard schematic elements and footprints for 5mm, 3mm, 1206, and 0603 sized LEDs. 5mm - Spark Fun Electronics SKU : COM-00529 (and others)
R1-R19 R22-R28 R30-R40 = PecanPico6:RES-0402
R20 R21 = sven:RES-0402
SJ1 SJ2 = PecanPico6:SJ2W: SMD solder JUMPER
SJ3 SJ7 = PecanPico6:SJ: SMD solder JUMPER
U$1 = GDynamics:MICROSD_SPI_MODE: MOLEX - 49225-0821 - CONNECTEUR MICRO SD PUSH/PUSH REV Fabricant: MOLEX Code commande Farnell: 1366700 <http://fr.farnell.com/molex/49225-0821/connecteur-micro-sd-push-push-rev/dp/1366700?Ntt=1366700> Référence fabricant: 49225-0821
U$2 = PecanPico6:AS213-92LF
U$3 = PecanFemto3:TXC_7Z
U$4 = PecanPico6:JTI_ANTENNA-1575AT43A40
X1 = con-molex:52745-2490: FFC/FPC-to-Board 0.50mm (.020") SMT Top Contact Right Angle, ZIF, Style Receptacle 52745 / 52435 Source: http://www.molex.com/product/ffc/52745.html; OC_FARNELL: unknown; OC_NEWARK: unknown